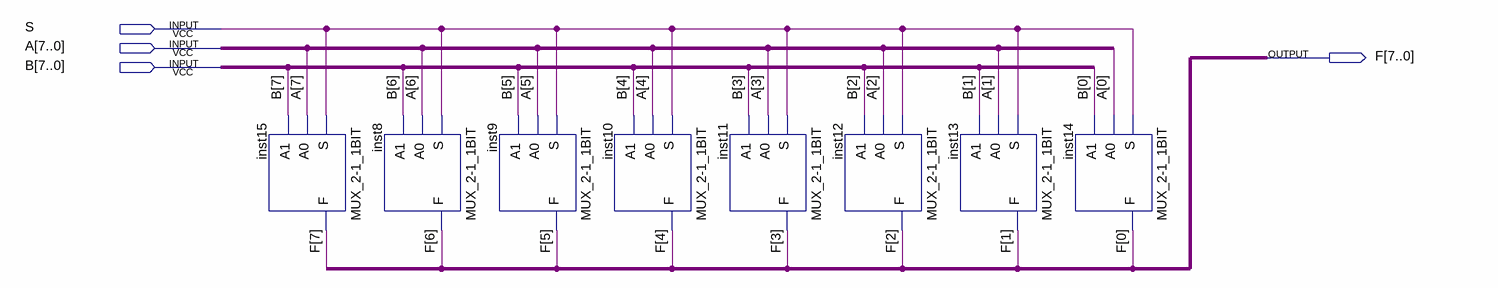
[diagram p0: schematic sheet]
// Quartus schematic MUX_2-1_8BIT.bdf as structural Verilog: 8 symbols, 4 pins
module \MUX_2-1_8BIT  (
  input  S,
  input  [7:0] A,
  input  [7:0] B,
  output [7:0] F
);

  \MUX_2-1_1BIT  inst15 (.S(S), .A0(A[7]), .A1(B[7]), .F(F[7]));
  \MUX_2-1_1BIT  inst8 (.S(S), .A0(A[6]), .A1(B[6]), .F(F[6]));
  \MUX_2-1_1BIT  inst9 (.S(S), .A0(A[5]), .A1(B[5]), .F(F[5]));
  \MUX_2-1_1BIT  inst10 (.S(S), .A0(A[4]), .A1(B[4]), .F(F[4]));
  \MUX_2-1_1BIT  inst11 (.S(S), .A0(A[3]), .A1(B[3]), .F(F[3]));
  \MUX_2-1_1BIT  inst12 (.S(S), .A0(A[2]), .A1(B[2]), .F(F[2]));
  \MUX_2-1_1BIT  inst13 (.S(S), .A0(A[1]), .A1(B[1]), .F(F[1]));
  \MUX_2-1_1BIT  inst14 (.S(S), .A0(A[0]), .A1(B[0]), .F(F[0]));
endmodule
